# Altium project EtherIOv3_2.PrjPcb
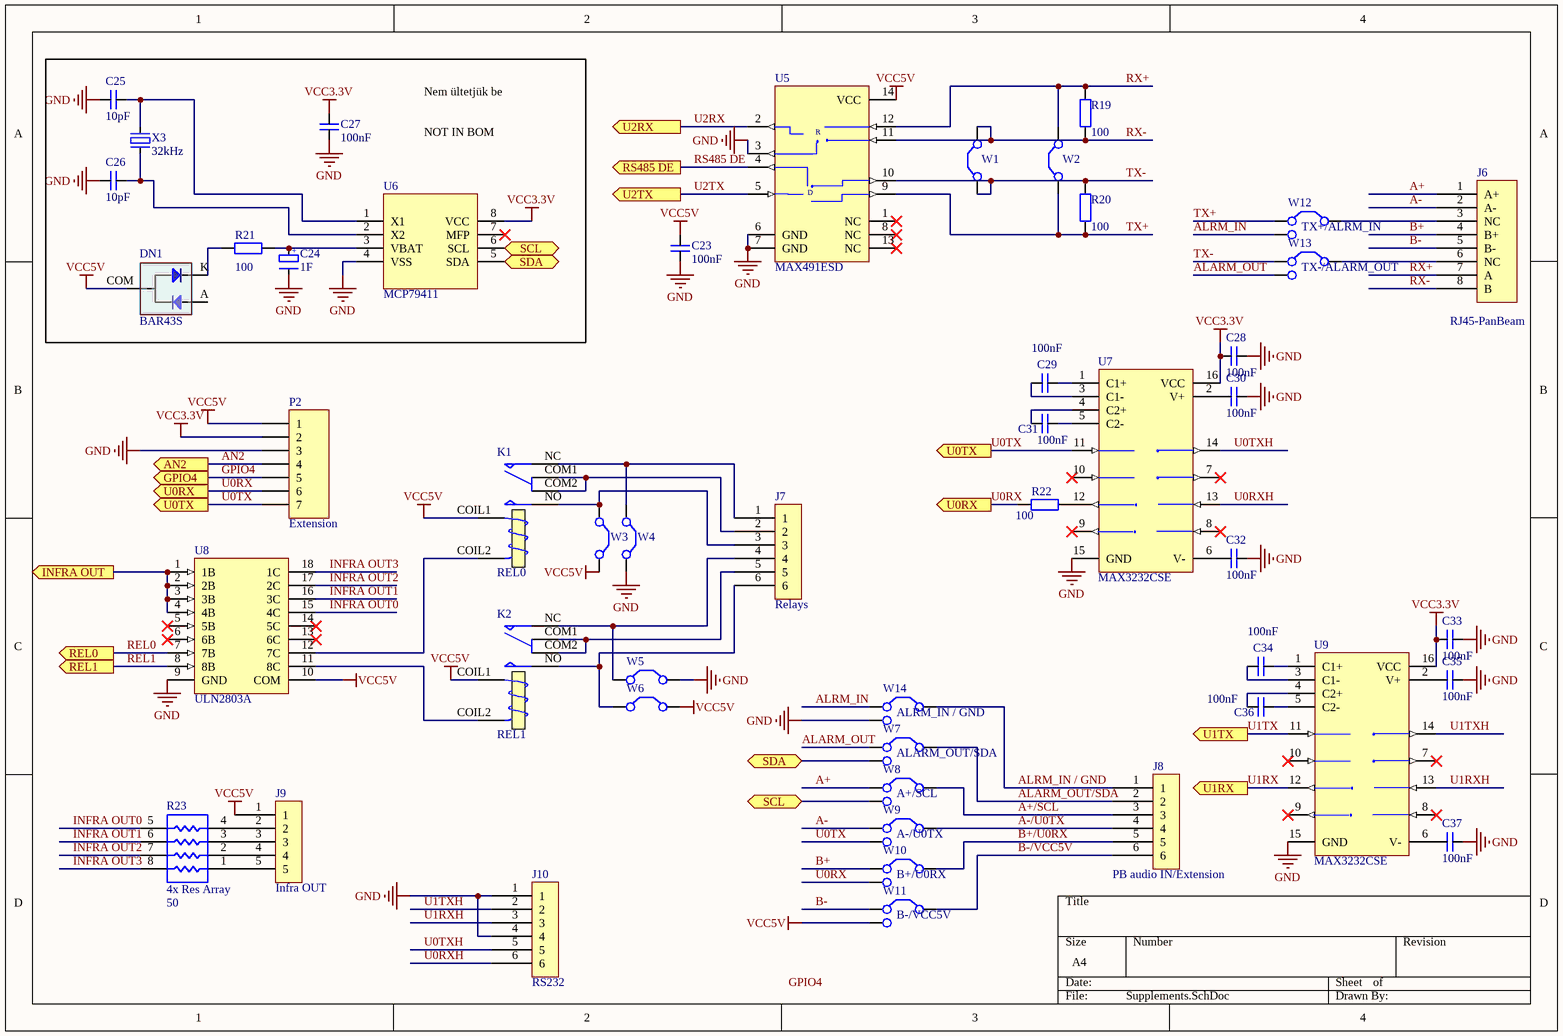
[diagram p0: Supplements.SchDoc]
1 sheet, 49 parts. Net scope: flat (ports and power ports of the same name join across sheets).
Board file: EtherIOv3_2.PcbDoc

## Sheet Supplements.SchDoc
size A4; PageSetup: Record=PageOptions|CenterHorizontal=True|CenterVertical=True|PrintScale=1.00|XCorrection=1.00|YCorrection=1.00|PrintKind=0|BorderSize=5000000|LeftOffset=0|BottomOffset=0|Orientation=2|PaperLength=1000|PaperWidth=1000|Scale=100|PaperSource=7|PrintQuality=-4|MediaType=1|DitherType=10|PaperKind=A4|PrintScaleMode=1

### Parts
C23  value 100nF  [0805 CAP]  (hidden comment: CAP)
C24  value 1F  [Goldcap_1F]  (hidden comment: ELKO)  (no BOM)
C25  value 10pF  [0805 CAP]  (hidden comment: CAP)  (no BOM)
C26  value 10pF  [0805 CAP]  (hidden comment: CAP)  (no BOM)
C27  value 100nF  [0805 CAP]  (hidden comment: CAP)  (no BOM)
C28  value 100nF  [0805 CAP]  (hidden comment: CAP)
C29  value 100nF  [0805 CAP]  (hidden comment: CAP)
C30  value 100nF  [0805 CAP]  (hidden comment: CAP)
C31  value 100nF  [0805 CAP]  (hidden comment: CAP)
C32  value 100nF  [0805 CAP]  (hidden comment: CAP)
C33  value 100nF  [0805 CAP]  (hidden comment: CAP)
C34  value 100nF  [0805 CAP]  (hidden comment: CAP)
C35  value 100nF  [0805 CAP]  (hidden comment: CAP)
C36  value 100nF  [0805 CAP]  (hidden comment: CAP)
C37  value 100nF  [0805 CAP]  (hidden comment: CAP)
DN1  BAR43S  [DIODE_SOT23_serial]  (no BOM)
J6  RJ45-PanBeam  [JACK1.27-2H8B]
J7  Relays  [Euroblock 3.5pitch 6P]
J8  PB audio IN/Extension  [Euroblock 3.5pitch 6P]
J9  Infra OUT  [Euroblock 3.5pitch 5P]
J10  RS232  [Euroblock 3.5pitch 6P]
K1  REL0  [RSY-12]
K2  REL1  [RSY-12]
P2  Extension  [HDR1X7]
R19  value 100  [0805 RES]  (hidden comment: RES)
R20  value 100  [0805 RES]  (hidden comment: RES)
R21  value 100  [0805 RES]  (hidden comment: RES)  (no BOM)
R22  value 100  [0805 RES]  (hidden comment: RES)
R23  4x Res Array  value 50  [1206 4xRES ARRAY]
U5  MAX491ESD  [NSO14_N]
U6  MCP79411  [MSOP8]  (no BOM)
U7  MAX3232CSE  [NSO16_M]
U8  ULN2803A  [SOIC127P1030X265-18N]
U9  MAX3232CSE  [NSO16_M]
W1  Jumper  [Jumper]  (value not drawn)
W2  Jumper  [Jumper]  (value not drawn)
W3  Jumper  [Jumper]  (value not drawn)
W4  Jumper  [Jumper]  (value not drawn)
W5  Jumper  [Jumper]  (value not drawn)
W6  Jumper  [Jumper]  (value not drawn)
W7  ALARM_OUT/SDA  [0603 3WAY JUMPER]
W8  A+/SCL  [0603 3WAY JUMPER]
W9  A-/U0TX  [0603 3WAY JUMPER]
W10  B+/U0RX  [0603 3WAY JUMPER]
W11  B-/VCC5V  [0603 3WAY JUMPER]
W12  TX+/ALRM_IN  [0603 3WAY JUMPER]
W13  TX-/ALARM_OUT  [0603 3WAY JUMPER]
W14  ALRM_IN / GND  [0603 3WAY JUMPER]
X3  value 32kHz  [CRYSTAL_mini]  (hidden comment: CRYSTAL)  (no BOM)

### Ports
AN2, GPIO4, INFRA OUT, REL0, REL1, RS485 DE, SCL, SDA, U0RX, U0TX, U1RX, U1TX, U2RX, U2TX

### Nets
GND: C23.2(B) C24.1(B) C25.1(A) C26.1(A) C27.2(B) C28.2(B) C30.2(B) C32.2(B) C33.2(B) C35.2(B) C37.2(B) J10.1 J10.4 P2.3 U5.3(~{RE}) U5.6(GND) U5.7(GND) U6.4(VSS) U7.15(GND) U8.9(GND) U9.15(GND) W4.2(C2) W5.2(C2) W14.3(C1)
VCC3.3V: C27.1(A) C28.1(A) C33.1(A) P2.2 U6.8(VCC) U7.16(VCC) U9.16(VCC)
VCC5V: C23.1(A) DN1.COM J9.1 K1.COIL1 K2.COIL1 P2.1 U5.14(VCC) U8.10(COM) W3.2(C2) W6.2(C2) W11.3(C1)
A+: J6.1(A+) W8.1(C1)
A+/SCL: J8.3 W8.2(C2)
A-: J6.2(A-) W9.1(C1)
A-/U0TX: J8.4 W9.2(C2)
ALARM_OUT: W7.1(C1) W13.3(C1)
ALARM_OUT/SDA: J8.2 W7.2(C2)
ALRM_IN: W12.3(C1) W14.1(C1)
ALRM_IN / GND: J8.1 W14.2(C2)
AN2: P2.4 ; port AN2
B+: J6.4(B+) W10.1(C1)
B+/U0RX: J8.5 W10.2(C2)
B-: J6.5(B-) W11.1(C1)
B-/VCC5V: J8.6 W11.2(C2)
GPIO4: P2.5 ; port GPIO4
INFRA OUT0: R23.5 U8.15(4C)
INFRA OUT1: R23.6 U8.16(3C)
INFRA OUT2: R23.7 U8.17(2C)
INFRA OUT3: R23.8 U8.18(1C)
REL0: U8.7(7B) ; port REL0
REL1: U8.8(8B) ; port REL1
RS485 DE: U5.4(DE) ; port RS485 DE
RX+: J6.7(A) R19.2 U5.12(A) W2.2(C2)
RX-: J6.8(B) R19.1 U5.11(B) W1.2(C2)
TX+: R20.1 U5.9(Y) W2.1(C1) W12.1(C1)
TX-: R20.2 U5.10(Z) W1.1(C1) W13.1(C1)
U0RX: P2.6 R22.1 W10.3(C1) ; port U0RX
U0RXH: J10.6 U7.13(R1IN)
U0TX: P2.7 U7.11(T1IN) W9.3(C1) ; port U0TX
U0TXH: J10.5 U7.14(T1OUT)
U1RX: U9.12(R1OUT) ; port U1RX
U1RXH: J10.3 U9.13(R1IN)
U1TX: U9.11(T1IN) ; port U1TX
U1TXH: J10.2 U9.14(T1OUT)
U2RX: U5.2(RO) ; port U2RX
U2TX: U5.5(DI) ; port U2TX
NetC24_2: C24.2(A) R21.2 U6.3(VBAT)
NetC25_2: C25.2(B) U6.1(X1) X3.1(A)
NetC26_2: C26.2(B) U6.2(X2) X3.2(B)
NetC29_1: C29.1(A) U7.3(C1-)
NetC29_2: C29.2(B) U7.1(C1+)
NetC30_1: C30.1(A) U7.2(V+)
NetC31_1: C31.1(A) U7.4(C2+)
NetC31_2: C31.2(B) U7.5(C2-)
NetC32_1: C32.1(A) U7.6(V-)
NetC34_1: C34.1(A) U9.3(C1-)
NetC34_2: C34.2(B) U9.1(C1+)
NetC35_1: C35.1(A) U9.2(V+)
NetC36_1: C36.1(A) U9.4(C2+)
NetC36_2: C36.2(B) U9.5(C2-)
NetC37_1: C37.1(A) U9.6(V-)
NetDN1_K: DN1.K R21.1
NetJ6_3: J6.3(NC) W12.2(C2)
NetJ6_6: J6.6(NC) W13.2(C2)
NetJ7_1: J7.1 K1.NC W4.1(C1)
NetJ7_2: J7.2 K1.COM1(COM) K1.COM2(COM)
NetJ7_3: J7.3 K1.NO W3.1(C1)
NetJ7_4: J7.4 K2.NC W5.1(C1)
NetJ7_5: J7.5 K2.COM1(COM) K2.COM2(COM)
NetJ7_6: J7.6 K2.NO W6.1(C1)
NetJ9_2: J9.2 R23.4
NetJ9_3: J9.3 R23.3
NetJ9_4: J9.4 R23.2
NetJ9_5: J9.5 R23.1
NetK1_COIL2: K1.COIL2 U8.12(7C)
NetK2_COIL2: K2.COIL2 U8.11(8C)
NetR22_2: R22.2 U7.12(R1OUT)
NetU6_5: U6.5(SDA) W7.3(C1) ; port SDA
NetU6_6: U6.6(SCL) W8.3(C1) ; port SCL
NetU8_1: U8.1(1B) U8.2(2B) U8.3(3B) U8.4(4B) ; port INFRA OUT

Not connected (* = marked no-connect by the designer): DN1 A; U5 1(NC)* 8(NC)* 13(NC)*; U6 7(MFP)*; U7 7(T2OUT)* 8(R2IN)* 9(R2OUT)* 10(T2IN)*; U8 5(5B)* 6(6B)* 13(6C)* 14(5C)*; U9 7(T2OUT)* 8(R2IN)* 9(R2OUT)* 10(T2IN)*

### Notes on the sheet
- Nem ültetjük be
- NOT IN BOM
- Labels drawn without touching a wire or pin: GPIO4
- (in symbol ELKO) +
- (in symbol MAX491ESD) R; D

### Library data of the parts
C23 C25-C37 = CAP: Capacitor
  C23 C27-C37: Order info: 82-01-25
  C25 C26: Order info: 82-08-40
C24 = ELKO: Electrolit Capacitor; Order info: 12-05-27
J6 = RJ45-PanBeam: PanBeam - RS485 + 2xAudio; Order info: 43-14-68
J7 J8 J10 = Euroblock 6P connector: Order info: Euroblock 6P connector
J9 = Euroblock 5P connector: Order info: Euroblock 5P connector
K1 K2 = Relay: SPDT Relay; Published: 8-Jun-2000; LatestRevisionDate: 17-Jul-2002; LatestRevisionNote: Re-released for DXP Platform.; PackageReference: MODULE5B; Publisher: Altium Limited; Order info: 42-16-40
P2 = Header 7: Header, 7-Pin; Order info: Nem ültetjük be; LatestRevisionDate: 17-Jul-2002; LatestRevisionNote: Re-released for DXP Platform.; Publisher: Altium Limited
R19-R22 = RES: Resistor; Published: 8-Jun-2000; LatestRevisionDate: 17-Jul-2002; LatestRevisionNote: Re-released for DXP Platform.; PackageReference: AXIAL-0.4; Publisher: Altium Limited; Order info: 81-10-75
R23 = 4x Res Array: Isolated Resistor Network; Published: 24-Mar-1999; LatestRevisionDate: 29-May-2009; LatestRevisionNote: IPC-7351 Footprint Added.; PackageReference: SO-16; Publisher: Altium Limited; PackageDescription: 16-Pin Small Outline Integrated Circuit 1.27 mm Pitch; Code_JEDEC: MS-012-AC; Code_IPC: SOIC127P600-16; Order info: 94-00-88
U5 = MAX491ESD: Low-Power, Slew-Rate-Limited RS-485/RS-422 Transceiver; Published: 16-Jan-2001; LatestRevisionDate: 13-Apr-2006; LatestRevisionNote: IPC-7351 Footprint Added.; DatasheetVersion: Feb-1996; PackageReference: NSO14; Publisher: Altium Limited; PackageDescription: 14-Pin Small Outline Integrated Circuit 1.27 mm Pitch; Code_JEDEC: MS-012-AB; Code_IPC: SOIC127P600-14; ComponentLink1Description: Manufacturer Link; ComponentLink1URL: http://www.maxim-ic.com/; ComponentLink2Description: Datasheet; ComponentLink2URL: http://pdfserv.maxim-ic.com/en/ds/MAX1487-MAX491.pdf; Order info: http://hu.farnell.com/exar/sp491en-l/ic-transceiver-rs-485-smd-491/dp/1296654
U6 = MCP79411: MCP79411 I2C RTCC + MAC; Order info: Nem ültetjük be
U7 U9 = MAX3232CSE: 3.0V TO 5.5V, Low-Power, up to 1Mbps, True RS-232 Transceiver Using Four 0.1µF External Capacitor; Published: 16-Jan-2001; LatestRevisionDate: 13-Apr-2006; LatestRevisionNote: IPC-7351 Footprint Added.; DatasheetVersion: Mar-1999; PackageReference: NSO16; Publisher: Altium Limited; PackageDescription: 16-Pin Small Outline Integrated Circuit 1.27 mm Pitch; Code_JEDEC: MS-012-AC; Code_IPC: SOIC127P600-16; ComponentLink1Description: Manufacturer Link; ComponentLink1URL: http://www.maxim-ic.com/; ComponentLink2Description: Datasheet; ComponentLink2URL: http://pdfserv.maxim-ic.com/en/ds/MAX3222-MAX3241.pdf; Order info: 89-12-11
U8 = ULN2803A: 8xDarlington Driver; Order info: 89-04-73
W1-W6 = Jumper: Jumper Wire; Published: 24-Mar-1999; LatestRevisionDate: 17-Jul-2002; LatestRevisionNote: Re-released for DXP Platform.; PackageReference: RAD-0.2; Publisher: Altium Limited; Order info: 43-17-58
W7-W14 = Jumper_3way: Jumper Wire; Order info: Nem alkatrész; Published: 24-Mar-1999; LatestRevisionDate: 17-Jul-2002; LatestRevisionNote: Re-released for DXP Platform.; PackageReference: RAD-0.2; Publisher: Altium Limited
DN1 = BAR43S: Order info: 83-01-05
X3 = CRYSTAL: Order info: 40-00-51